# Altium schematic sheet PI_loop_testing.SchDoc
size A
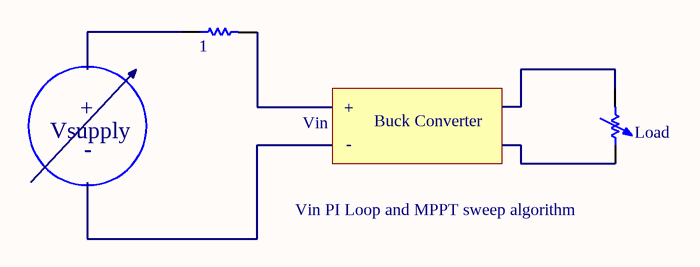
[diagram p0: PI_loop_testing.SchDoc]

## Parts
R1  value 1  [AXIAL-0.3]  (hidden comment: Res1)
R2  value Load  [AXIAL-0.7]  (hidden comment: Res Adj1)

## Nets

Not connected (* = marked no-connect by the designer): R1 1 2; R2 1 2

## Notes on the sheet
- Vsupply
- +
- -
- Vin
- Buck Converter
- (near R2) Vin PI Loop and MPPT sweep algorithm

## Library data of the parts
R1 = Res1: Resistor; Published: 8-Jun-2000; LatestRevisionDate: 17-Jul-2002; LatestRevisionNote: Re-released for DXP Platform.; PackageReference: AXIAL-0.3; Publisher: Altium Limited; PackageDescription: Axial Device, Thru-Hole; 2 Leads; 0.3 in Pin Spacing
R2 = Res Adj1: Variable Resistor; Set Position: 0.5; Published: 8-Jun-2000; LatestRevisionDate: 17-Jul-2002; LatestRevisionNote: Re-released for DXP Platform.; PackageReference: AXIAL-0.7; Publisher: Altium Limited; PackageDescription: Axial Device, Thru-Hole; 2 Leads; 0.7 in Pin Spacing